# EAGLE design ArduTouch_stereo_v1.2c (EAGLE 7.5.0)
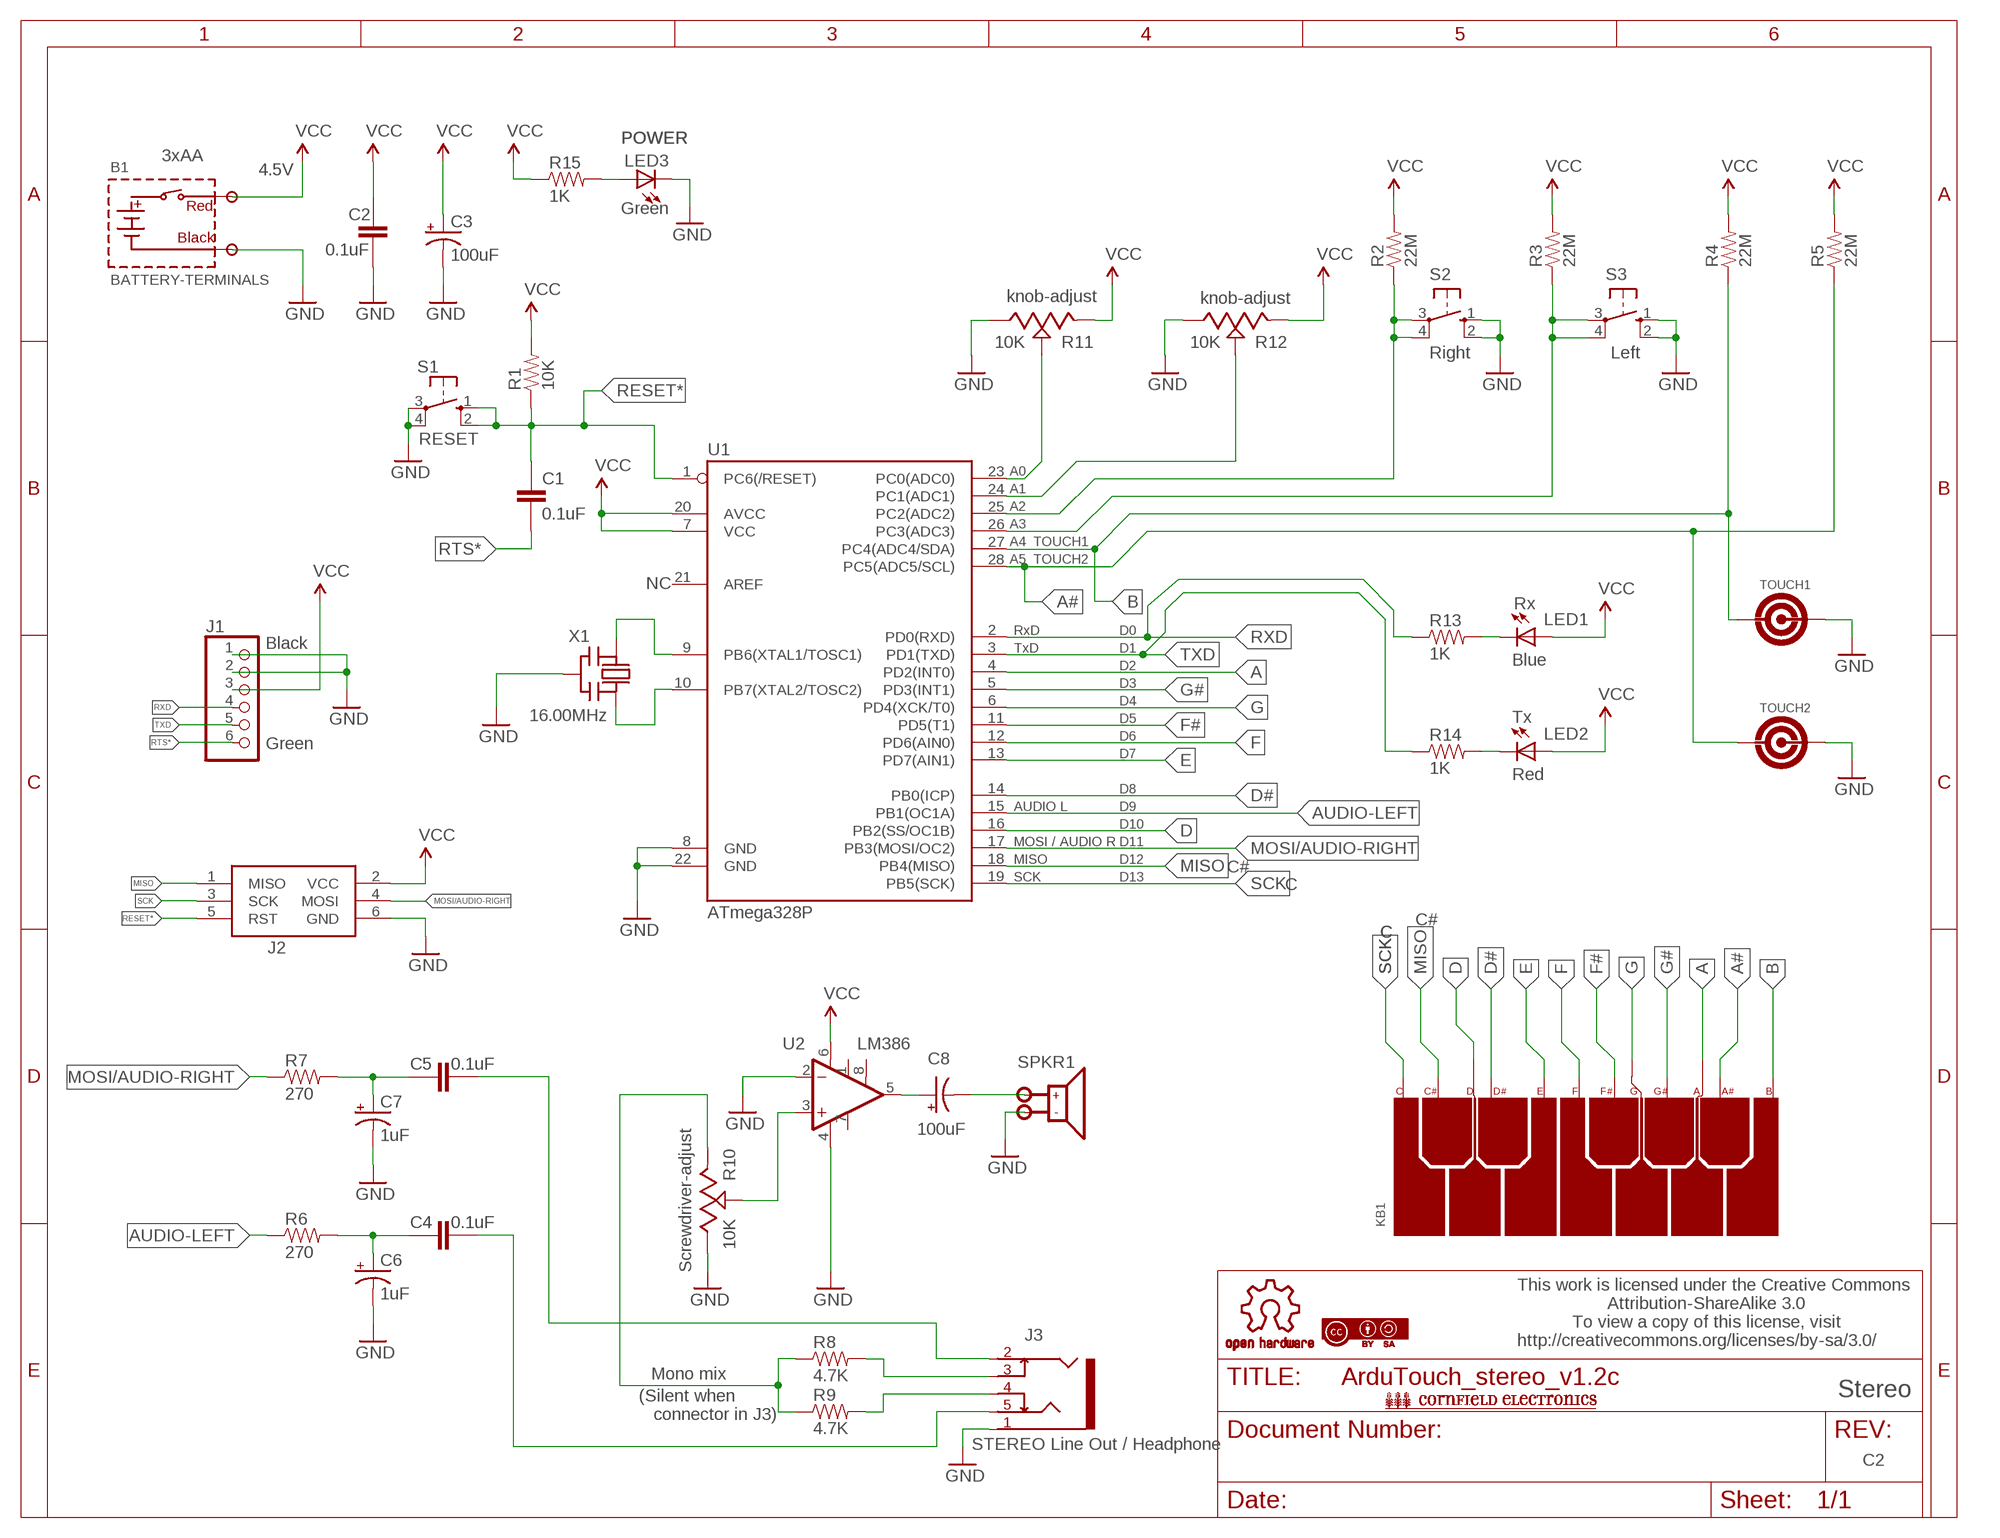
[diagram p0: schematic, sheet 1]

## Parts
B1  BATTERY-TERMINALS  [BATTERY-TERMINALS]
C1  0.1uF  CAPPTH  [CAP-PTH-SMALL]
C2  0.1uF  CAPPTH  [CAP-PTH-SMALL]
C3  100uF  CPOL-RADIAL-10UF-25V  [CPOL-RADIAL-10UF-25V]
C4  0.1uF  CAPPTH  [CAP-PTH-SMALL]
C5  0.1uF  CAPPTH  [CAP-PTH-SMALL]
C6  1uF  CPOL-RADIAL-10UF-25V  [CPOL-RADIAL-10UF-25V]
C7  1uF  CPOL-RADIAL-10UF-25V  [CPOL-RADIAL-10UF-25V]
C8  100uF  CPOL-RADIAL-10UF-25V  [CPOL-RADIAL-10UF-25V]
J1  PINHD-1X6LOCK  [1X06-BIGLOCK]
J2  ISP  AVRISP-6  [AVRISP]
J3  STEREO-AUDIO-3.5MM-SWITCHED  [STEREO-AUDIO-3.5MM-SWITCHED]
KB1  PCB-KEYBOARD4  [PCB-KEYBOARD4]
LED1  Blue  LED5MM  [LED5MM]
LED2  Red  LED5MM  [LED5MM]
LED3  Green  LED5MM  [LED5MM]
R1  10K  RESISTORPTH-1/4W  [AXIAL-0.4]
R2  22M  RESISTORPTH-1/4W  [AXIAL-0.4]
R3  22M  RESISTORPTH-1/4W  [AXIAL-0.4]
R4  22M  RESISTORPTH-1/4W  [AXIAL-0.4]
R5  22M  RESISTORPTH-1/4W  [AXIAL-0.4]
R6  270  RESISTORPTH-1/4W  [AXIAL-0.4]
R7  270  RESISTORPTH-1/4W  [AXIAL-0.4]
R8  4.7K  RESISTORPTH-1/4W  [AXIAL-0.4]
R9  4.7K  RESISTORPTH-1/4W  [AXIAL-0.4]
R10  10K  TRIMPOT-3319P-1  [TRIMPOT-3319P-1]
R11  10K  TRIMPOT-72PTR  [TRIMPOT-72PTR]
R12  10K  TRIMPOT-72PTR  [TRIMPOT-72PTR]
R13  1K  RESISTORPTH-1/4W  [AXIAL-0.4]
R14  1K  RESISTORPTH-1/4W  [AXIAL-0.4]
R15  1K  RESISTORPTH-1/4W  [AXIAL-0.4]
S1  TACTILE_SWITCH_6.3MM  [TACTILE_SWITCH_6.3MM]
S2  TACTILE_SWITCH_6.3MM  [TACTILE_SWITCH_6.3MM]
S3  TACTILE_SWITCH_6.3MM  [TACTILE_SWITCH_6.3MM]
SPKR1  SPEAKER-TERMINALS  [SPEAKER-TERMINALS]
TOUCH1  PCB-TOUCHPAD2  [PCB-TOUCHPAD2]
TOUCH2  PCB-TOUCHPAD2  [PCB-TOUCHPAD2]
U1  ATmega328P  ATMEGA328P_PDIP  [DIL28-3]
U2  LM386  [DIP08]
U$1  OSH-LOGO  [OSH-LOGO]
U$2  CC-BY-SA-LOGO2  [CC-BY-SA-LOGO2]
U$3  CORNFIELD-LOGO  [CORNFIELD-LOGO]
X1  16.00MHz  CERMOSCILL-THM  [CERM_OSC]

## Nets
A: KB1.A U1.4(PD2(INT0))
A0: R11.2(S) U1.23(PC0(ADC0))
A1: R12.2(S) U1.24(PC1(ADC1))
A2: R2.P$1 S2.3 S2.4 U1.25(PC2(ADC2))
A#: KB1.A# R5.P$1 TOUCH2.1 U1.28(PC5(ADC5/SCL))
AUDIO-LEFT: R6.P$1 U1.15(PB1(OC1A))
B: KB1.B R4.P$1 TOUCH1.1 U1.27(PC4(ADC4/SDA))
C+: R3.P$1 S3.3 S3.4 U1.26(PC3(ADC3))
D: KB1.D U1.16(PB2(SS/OC1B))
D#: KB1.D# U1.14(PB0(ICP))
E: KB1.E U1.13(PD7(AIN1))
F: KB1.F U1.12(PD6(AIN0))
F#: KB1.F# U1.11(PD5(T1))
G: KB1.G U1.6(PD4(XCK/T0))
G#: KB1.G# U1.5(PD3(INT1))
GND: B1.- C2.2 C3.- C6.- C7.- J1.1 J1.2 J2.6(GND) J3.1 LED3.K(C) R10.A R11.3(A) R12.3(A) S1.3 S1.4 S2.1 S2.2 S3.1 S3.2 SPKR1.- TOUCH1.2 TOUCH2.2 U1.8(GND) U1.22(GND) U2.2(-IN) U2.4(V-) X1.P$2(GND)
MISO: J2.1(MISO) KB1.C# U1.18(PB4(MISO))
MOSI/AUDIO-RIGHT: J2.4(MOSI) R7.P$1 U1.17(PB3(MOSI/OC2))
N$1: C8.- SPKR1.+
N$2: U1.9(PB6(XTAL1/TOSC1)) X1.P$1(IN)
N$3: U1.10(PB7(XTAL2/TOSC2)) X1.P$3(OUT)
N$4: C5.1 C7.+ R7.P$2
N$5: C8.+ U2.5(OUT)
N$6: J3.3 R8.P$2
N$7: J3.4 R9.P$2
N$8: R10.S U2.3(+IN)
N$9: C5.2 J3.2
N$10: C4.1 C6.+ R6.P$2
N$11: LED1.K(C) R13.P$2
N$12: LED2.K(C) R14.P$2
N$13: C4.2 J3.5
N$14: LED3.A R15.P$2
N$16: R8.P$1 R9.P$1 R10.E
RESET*: C1.1 J2.5(RST) R1.P$1 S1.1 S1.2 U1.1(PC6(/RESET))
RTS*: C1.2 J1.6
RXD: J1.4 R13.P$1 U1.2(PD0(RXD))
SCK: J2.3(SCK) KB1.C U1.19(PB5(SCK))
TXD: J1.5 R14.P$1 U1.3(PD1(TXD))
VCC: B1.+ C2.1 C3.+ J1.3 J2.2(VCC) LED1.A LED2.A R1.P$2 R2.P$2 R3.P$2 R4.P$2 R5.P$2 R11.1(E) R12.1(E) R15.P$1 U1.7(VCC) U1.20(AVCC) U2.6(V+)
Unconnected: U1.21(AREF) U2.1(GAIN) U2.7(BP) U2.8(GAIN)

## Notes on the sheet
- POWER | POWER
- 3xAA
- 4.5V
- knob-adjust | knob-adjust
- Right | Left
- RESET
- A0
- A1
- A2
- A3
- A4 | TOUCH1
- A5 | TOUCH2
- NC
- Rx
- RxD | D0
- Black | TxD | D1
- D2
- D3
- D4
- D5 | Tx
- D6
- Green
- D7
- D8
- AUDIO L | D9
- D10
- MOSI / AUDIO R | D11
- MISO | D12
- C#
- SCK | D13
- C
- C#
- C | C
- Screwdriver-adjust
- This work is licensed under the Creative Commons
                    Attribution-ShareAlike 3.0
             To view a copy of this license, visit
  http://creativecommons.org/licenses/by-sa/3.0/
- Mono mix
- Stereo
- (Silent when
     connector in J3)
- STEREO Line Out / Headphone
- C2

## Library data of the parts
B1 = Mitch-parts:BATTERY-TERMINALS: Battery terminals for 3xAA battery with switch with strain-relief holes
C1 C2 C4 C5 = Mitch-parts:CAP: Capacitor Standard 0603 ceramic capacitor, and 0.1" leaded capacitor.
C3 C6-C8 = Mitch-parts:CPOL-RADIAL-10UF-25V: Electrolytic Polarized
J1 = adafruit:PINHD-1X6: PIN HEADER
J2 = adafruit:AVRISP: AVR ISP HEADER Standard 6 pin header for AVR programming
J3 = Mitch-parts:STEREO-AUDIO-3.5MM-SWITCHED: 3.5mm mono audio jack, with switch Kycon STX-3120-5B-284C (284C is blue) Mouser part #: 806-STX-31205B284C (blue) 1 - ground 2 - tip 3 - tip switch 4 - ring switch 5 - ring
KB1 = Mitch-parts:PCB-KEYBOARD4: 1-octave PCB touch keyboard (without top C)
LED1-LED3 = Mitch-parts:LED5MM: LED, 5mm
R1-R9 R13-R15 = SparkFun-Passives:RESISTOR: Resistor Basic schematic elements and footprints for 0603, 1206, and PTH resistors.
R10 = Mitch-parts:TRIMPOT-3319P-1: Trimpot -- screwdriver adjust Bourns 3319P-1-103 (10K) Top Adjust Mouser part #: 652-3319P-1-103 (10K)
R11 R12 = Mitch-parts:TRIMPOT-72PTR: Trimpot -- knob adjust BI Technologies / TT Electronics 72PTR10KLF (10K) Mouser part #: 858-72PTR10KLF (10K)
S1-S3 = Mitch-parts:TACTILE_SWITCH_6.3MM: Tactile Switch 6.3mm x 6.3mm
SPKR1 = Mitch-parts:SPEAKER-TERMINALS: Speaker Terminals pads spaced 12mm holes: to fit 0.8mm (0.03") wires
TOUCH1 TOUCH2 = Mitch-parts:PCB-TOUCHPAD2: PCB resistive Touch-pad for touch-switch
U1 = SparkFun-DigitalIC:ATMEGA328P_PDIP: uC used in the Arduino 32kb flash, 1k EEPROM, 2k SRAM This is the through-hole version of this chip.
U2 = Mitch-parts:LM386: low voltage audio power amplifier
U$1 = Mitch-parts:OSH-LOGO: OSH Logo
U$2 = Mitch-parts:CC-BY-SA-LOGO2: CC BY-SA logo
U$3 = Mitch-parts:CORNFIELD-LOGO: Cornfield Electronics logo
X1 = adafruit:CERMOSCILL: Ceramic oscillator with built in capacitors such as ZTT-12MHz http://www.ladyada.net/library/eagle

## Board
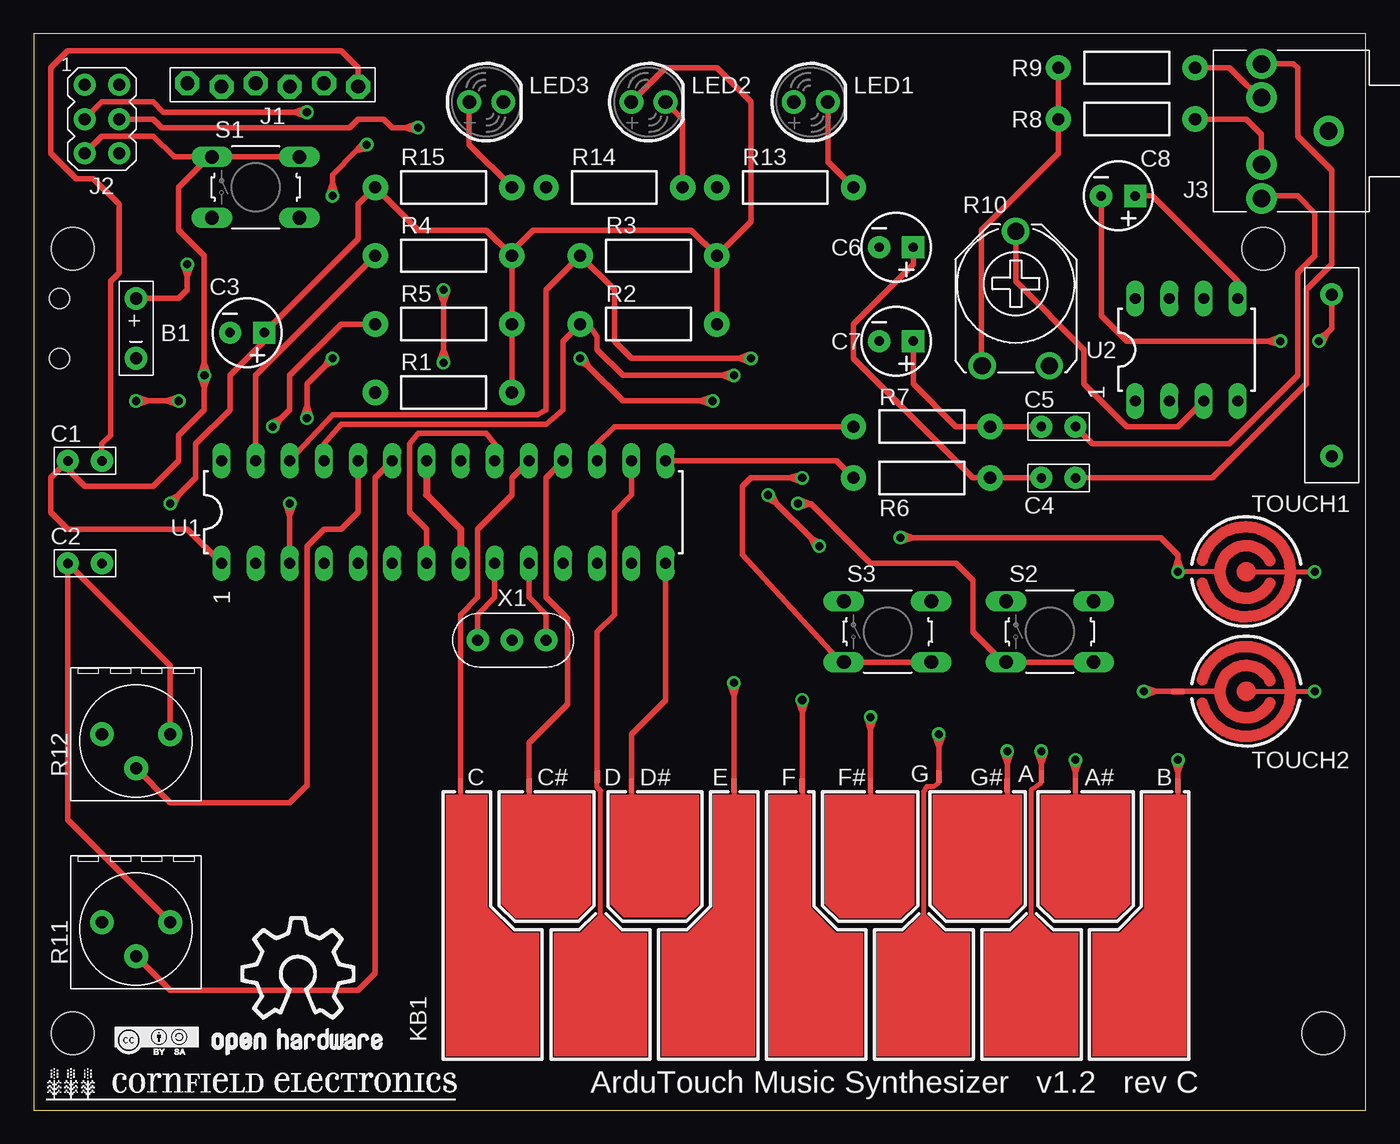
[diagram p1: board, top side]
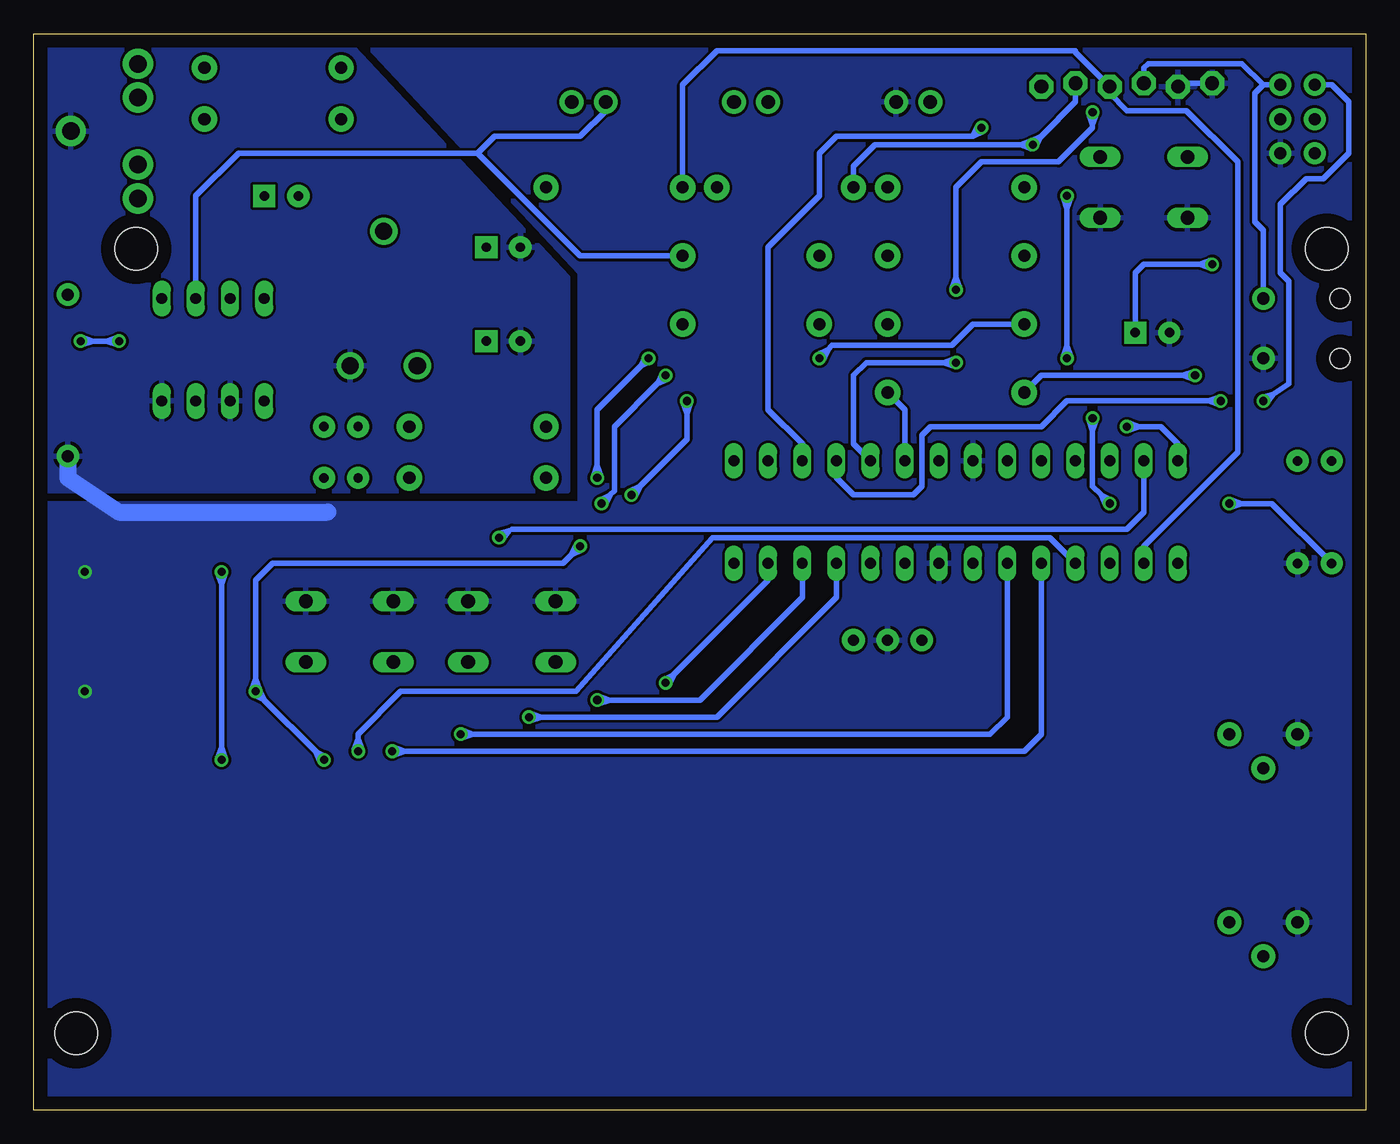
[diagram p2: board, bottom side, seen from below]

Size 99.06 x 80.01 mm. Coordinates in mm from the lower left corner, seen from the top.
Outline: 0,0 99.06,0 99.06,80.01 0,80.01 0,0
Copper layers (1*16): Top 0.035mm / dielectric 1.5mm / Bottom 0.035mm
Design rules "default *": minimum track width 10mil, minimum drill 20mil, track to track 8mil, track to pad 8mil, pad to pad 8mil, via to via 8mil, smd to smd 8mil, copper to edge 40mil, drill to drill 8mil, minimum pad ring 10mil, minimum via ring 8mil, stop-mask expansion 4mil, vias tented up to drill 0.61mm, thermal gap 10mil
Holes 3.17 mm at 2.92,5.71 95.89,5.71 91.44,64.01 2.92,64.01

### Footprints (pad centres in the part's own frame; a part is rotated, then mirrored left to right if it is on the bottom)
BATTERY-TERMINALS = drill 0.9 pad 1.676: + 0,2.54; - 0,-1.905 | hole 1.5: -5.715,-1.905; -5.715,2.54
CAP-PTH-SMALL = drill 0.7 pad 1.638: 1 -1.27,0; 2 1.27,0
CPOL-RADIAL-10UF-25V = drill 0.7 pad 1.651 square: + 1.27,0 | drill 0.7 pad 1.651: - -1.27,0
1X06-BIGLOCK = drill 1.016 pad 1.778 octagon: 1 -6.35,0.127; 2 -3.81,-0.127; 3 -1.27,0.127; 4 1.27,-0.127; 5 3.81,0.127; 6 6.35,-0.127
AVRISP = drill 0.9 pad 1.626: 1 -1.27,2.54; 2 1.27,2.54; 3 -1.27,0; 4 1.27,0; 5 -1.27,-2.54; 6 1.27,-2.54
STEREO-AUDIO-3.5MM-SWITCHED = drill 1.3 pad 2.261: 1 -1.05,0; 2 3.95,5; 3 3.95,2.5; 4 3.95,-2.5; 5 3.95,-5
PCB-KEYBOARD4 = smd 0.381 x 0.889: A 12.7,10.795; D -20.32,10.795; G 5.08,10.795 | smd 0.381 x 1.016: A# 15.24,10.16; B 22.86,10.16; C -30.48,10.16; C# -25.4,10.16; D# -17.78,10.16; E -10.16,10.16; F -5.08,10.16; F# 0,10.16; G# 10.16,10.16
LED5MM = drill 1.016 pad 1.778: A -1.27,0; K 1.27,0
AXIAL-0.4 = drill 0.9 pad 1.88: P$1 -5.08,0; P$2 5.08,0
TRIMPOT-3319P-1 = drill 1.27 pad 2.032: A 2.5,-5; E -2.5,-5; S 0,5
TRIMPOT-72PTR = drill 0.9 pad 1.778: 1 2.54,0; 2 0,-2.54; 3 -2.54,0
TACTILE_SWITCH_6.3MM = drill 1.016 long: 1 -3.251,2.261; 2 3.251,2.261; 3 -3.251,-2.261; 4 3.251,-2.261
SPEAKER-TERMINALS = drill 0.9 pad 1.676: + 0,6; - 0,-6
PCB-TOUCHPAD2 = smd 0.889 x 0.381: 1 -5.08,0; 2 5.08,0
DIL28-3 = drill 0.813 long: 1 -16.51,-3.81; 2 -13.97,-3.81; 3 -11.43,-3.81; 4 -8.89,-3.81; 5 -6.35,-3.81; 6 -3.81,-3.81; 7 -1.27,-3.81; 8 1.27,-3.81; 9 3.81,-3.81; 10 6.35,-3.81; 11 8.89,-3.81; 12 11.43,-3.81; 13 13.97,-3.81; 14 16.51,-3.81; 15 16.51,3.81; 16 13.97,3.81; 17 11.43,3.81; 18 8.89,3.81; 19 6.35,3.81; 20 3.81,3.81; 21 1.27,3.81; 22 -1.27,3.81; 23 -3.81,3.81; 24 -6.35,3.81; 25 -8.89,3.81; 26 -11.43,3.81; 27 -13.97,3.81; 28 -16.51,3.81
DIP08 = drill 0.813 long: 1 -3.81,-3.81; 2 -1.27,-3.81; 3 1.27,-3.81; 4 3.81,-3.81; 5 3.81,3.81; 6 1.27,3.81; 7 -1.27,3.81; 8 -3.81,3.81
CERM_OSC = drill 0.813 pad 1.676: P$1 -2.54,0; P$2 0,0; P$3 2.54,0

### Placement (x,y rotation side)
B1  7.62,57.78 0 top
C1  3.81,48.26 0 top
C2  3.81,40.64 0 top
C3  15.88,57.78 0 top
C4  76.2,46.99 0 top
C5  76.2,50.8 0 top
C6  64.14,64.14 0 top
C7  64.14,57.15 0 top
C8  80.64,67.94 0 top
J1  17.78,76.2 0 top
J2  5.08,73.66 0 top
J3  95.25,72.77 180 top
KB1  62.23,13.97 0 top
LED1  57.78,74.93 0 top
LED2  45.72,74.93 0 top
LED3  33.66,74.93 0 top
R1  30.48,53.34 0 top
R2  45.72,58.42 0 top
R3  45.72,63.5 0 top
R4  30.48,63.5 0 top
R5  30.48,58.42 0 top
R6  66.04,46.99 0 top
R7  66.04,50.8 0 top
R8  81.28,73.66 0 top
R9  81.28,77.47 0 top
R10  73.03,60.33 0 top
R11  7.62,13.97 0 top
R12  7.62,27.94 0 top
R13  55.88,68.58 0 top
R14  43.18,68.58 0 top
R15  30.48,68.58 0 top
S1  16.51,68.58 0 top
S2  75.56,35.56 0 top
S3  63.5,35.56 0 top
SPKR1  96.52,54.61 0 top
TOUCH1  90.17,40.01 0 top
TOUCH2  90.17,31.11 0 top
U1  30.48,44.45 0 top
U2  85.72,56.52 0 top
U$1  19.68,10.16 0 top
U$2  9.32,5.21 0 top
U$3  16.21,1.77 0 top
X1  35.56,34.92 0 top

### Tracks (layer width: path | path; a pad name or v marks a point on that pad's centre or on a via)
A  (via drill 0.6)
  Top 0.406: 74.93,25.77 v74.93,26.67 | 74.93,25.77 75.21,26.57 v74.93,26.67 | 74.93,25.77 74.65,26.57 v74.93,26.67 | KB1.A v74.93,26.67
  Bottom 0.406: v74.93,26.67 74.93,27.57 | 74.93,27.57 74.93,27.94 71.75,31.11 58.74,31.11 48.58,42.55 23.5,42.55 U1.4 | 74.93,27.57 74.65,26.77 v74.93,26.67 | 74.93,27.57 75.21,26.77 v74.93,26.67
A0
  Top 0.406: U1.23 25.4,46.99 25.4,19.05 25.4,10.16 24.13,8.89 10.16,8.89 R11.2
A1
  Top 0.406: U1.24 24.13,44.45 22.86,43.18 21.59,43.18 20.32,41.91 20.32,33.02 20.32,24.13 19.05,22.86 10.16,22.86 R12.2
A2  (via drill 0.6)
  Top 0.406: U1.25 21.59,49.53 22.86,50.99 38.1,50.99 39.37,52.07 39.37,57.15 R2.P$1 41.27,58.42 41.91,57.47 41.91,56.52 43.81,54.61 51.17,54.61 | 51.17,54.61 v52.07,54.61 | S2.4 S2.3 72.11,33.3 69.85,35.56 69.85,39.37 68.58,40.64 62.23,40.64 57.78,45.09 57.73,45.09 | 57.73,45.09 v56.83,45.09 | 51.17,54.61 51.97,54.33 v52.07,54.61 | 51.17,54.61 51.97,54.89 v52.07,54.61 | 57.73,45.09 56.93,45.37 v56.83,45.09 | 57.73,45.09 56.93,44.8 v56.83,45.09
  Bottom 0.406: v52.07,54.61 52.71,53.97 | 52.71,53.97 55.88,50.8 55.88,46.04 56.2,45.72 | 56.2,45.72 v56.83,45.09 | 52.71,53.97 52.34,54.74 v52.07,54.61 | 52.71,53.97 51.94,54.34 v52.07,54.61 | 56.2,45.72 56.56,44.96 v56.83,45.09 | 56.2,45.72 56.96,45.36 v56.83,45.09
A#  (via drill 0.6)
  Top 0.406: v40.64,55.88 41.28,55.24 | 41.28,55.24 43.81,52.7 49.58,52.7 | 49.58,52.7 v50.48,52.7 | v17.78,50.8 18.42,51.44 | 18.42,51.44 19.05,52.07 19.05,54.61 22.86,58.42 R5.P$1 | v58.42,41.91 57.78,42.55 | 57.78,42.55 55.25,45.08 | 55.25,45.08 v54.61,45.72 | 77.47,25.14 77.47,25.4 v77.47,26.04 | 88.24,31.11 83.45,31.11 | 83.45,31.11 v82.55,31.11 | 77.47,25.14 77.75,25.93 v77.47,26.04 | 77.47,25.14 77.19,25.93 v77.47,26.04 | 83.45,31.11 82.65,31.4 v82.55,31.11 | 83.45,31.11 82.65,30.83 v82.55,31.11 | 41.28,55.24 40.91,56.01 v40.64,55.88 | 41.28,55.24 40.51,55.61 v40.64,55.88 | 49.58,52.7 50.38,52.42 v50.48,52.7 | 49.58,52.7 50.38,52.99 v50.48,52.7 | 18.42,51.44 17.65,51.07 v17.78,50.8 | 18.42,51.44 18.05,50.67 v17.78,50.8 | 57.78,42.55 58.15,41.78 v58.42,41.91 | 57.78,42.55 58.55,42.18 v58.42,41.91 | 55.25,45.08 54.88,45.85 v54.61,45.72 | 55.25,45.08 54.48,45.45 v54.61,45.72 | KB1.A# 77.47,25.14
  Bottom 0.406: v77.47,26.04 78.11,26.67 | 78.11,26.67 81.91,30.48 | 81.91,30.48 v82.55,31.11 | R5.P$1 29.21,58.42 30.8,56.83 39.69,56.83 40,56.52 | v50.48,52.7 50.48,51.8 | 50.48,51.8 50.48,49.85 53.97,46.36 | 82.55,32.02 82.55,39.37 81.28,40.64 59.69,40.64 59.06,41.27 | 82.55,32.02 v82.55,31.11 | U1.28 13.97,49.53 15.24,50.8 16.88,50.8 | 16.88,50.8 v17.78,50.8 | 40,56.52 v40.64,55.88 | v54.61,45.72 53.97,46.36 | v58.42,41.91 59.06,41.27 | 78.11,26.67 77.34,26.31 v77.47,26.04 | 78.11,26.67 77.74,25.91 v77.47,26.04 | 81.91,30.48 82.68,30.84 v82.55,31.11 | 81.91,30.48 82.28,31.24 v82.55,31.11 | 82.55,32.02 82.27,31.21 v82.55,31.11 | 82.55,32.02 82.83,31.21 v82.55,31.11 | 40,56.52 40.37,55.75 v40.64,55.88 | 40,56.52 40.77,56.15 v40.64,55.88 | 50.48,51.8 50.77,52.6 v50.48,52.7 | 50.48,51.8 50.2,52.6 v50.48,52.7 | 16.88,50.8 17.68,50.52 v17.78,50.8 | 16.88,50.8 17.68,51.08 v17.78,50.8 | 59.06,41.27 58.69,42.04 v58.42,41.91 | 59.06,41.27 58.29,41.64 v58.42,41.91 | 53.97,46.36 54.34,45.59 v54.61,45.72 | 53.97,46.36 54.74,45.99 v54.61,45.72
AUDIO-LEFT
  Top 0.406: U1.15 59.69,48.26 R6.P$1
B  (via drill 0.6, 0.6 pad 0.3)
  Top 0.406: R4.P$1 16.51,54.61 U1.27 | 65.35,42.55 83.82,42.55 85.09,41.27 85.09,40.91 | 65.35,42.55 v64.45,42.55 | 85.09,25.14 85.09,25.4 v85.09,26.04 | TOUCH1.1 85.09,40.91 | 65.35,42.55 64.55,42.83 v64.45,42.55 | 65.35,42.55 64.55,42.26 v64.45,42.55 | 85.09,25.14 85.37,25.93 v85.09,26.04 | 85.09,25.14 84.81,25.93 v85.09,26.04 | 85.09,40.91 84.81,40.1 TOUCH1.1 | 85.09,40.91 85.37,40.1 TOUCH1.1 | KB1.B 85.09,25.14
  Bottom 0.406: v64.45,42.55 63.7,43.04 | 63.7,43.04 63.5,43.18 17.78,43.18 16.51,44.45 U1.27 | v85.09,26.04 85.09,26.93 | 85.09,26.93 85.09,39.1 | 85.09,39.1 TOUCH1.1 | 63.7,43.04 64.21,42.37 v64.45,42.55 | 63.7,43.04 64.53,42.84 v64.45,42.55 | 85.09,26.93 84.81,26.14 v85.09,26.04 | 85.09,26.93 85.37,26.14 v85.09,26.04 | 85.09,39.1 85.37,39.91 TOUCH1.1 | 85.09,39.1 84.81,39.91 TOUCH1.1
  other vias: 85.09,40.01
C+  (via drill 0.6)
  Top 0.406: U1.26 22.23,51.69 37.47,51.69 38.1,52.07 38.1,60.96 R3.P$1 43.18,60.96 43.18,57.15 44.45,55.88 52.44,55.88 | v53.34,55.88 52.44,55.88 | S3.4 S3.3 60.05,33.3 52.7,41.27 52.7,46.35 53.34,46.99 56.25,46.99 | 56.25,46.99 v57.15,46.99 | 56.25,46.99 57.05,46.71 v57.15,46.99 | 56.25,46.99 57.05,47.27 v57.15,46.99 | 52.44,55.88 53.24,55.6 v53.34,55.88 | 52.44,55.88 53.24,56.16 v53.34,55.88
  Bottom 0.406: 57.15,47.89 57.15,52.07 53.98,55.24 | 57.15,47.89 v57.15,46.99 | v53.34,55.88 53.98,55.24 | 57.15,47.89 56.87,47.09 v57.15,46.99 | 57.15,47.89 57.43,47.09 v57.15,46.99 | 53.98,55.24 53.61,56.01 v53.34,55.88 | 53.98,55.24 53.21,55.61 v53.34,55.88
D
  Top 0.406: U1.16 44.45,45.72 43.18,44.45 43.18,36.83 41.91,35.56 KB1.D
D#
  Top 0.406: U1.14 46.99,30.48 44.45,27.94 KB1.D#
E  (via drill 0.6)
  Top 0.406: 52.07,30.85 v52.07,31.75 | 52.07,30.85 52.35,31.65 v52.07,31.75 | 52.07,30.85 51.79,31.65 v52.07,31.75 | KB1.E 52.07,30.85
  Bottom 0.406: U1.13 44.45,39.37 51.43,32.39 | 51.43,32.39 v52.07,31.75 | 51.43,32.39 51.8,31.62 v52.07,31.75 | 51.43,32.39 52.2,32.02 v52.07,31.75
F  (via drill 0.6)
  Top 0.406: 57.15,29.58 v57.15,30.48 | 57.15,29.58 57.43,30.38 v57.15,30.48 | 57.15,29.58 56.87,30.38 v57.15,30.48 | KB1.F 57.15,29.58
  Bottom 0.406: U1.12 41.91,38.1 49.53,30.48 56.25,30.48 | 56.25,30.48 v57.15,30.48 | 56.25,30.48 57.05,30.2 v57.15,30.48 | 56.25,30.48 57.05,30.76 v57.15,30.48
F#  (via drill 0.6)
  Top 0.406: 62.23,28.31 v62.23,29.21 | 62.23,28.31 62.51,29.11 v62.23,29.21 | 62.23,28.31 61.95,29.11 v62.23,29.21 | KB1.F# 62.23,28.31
  Bottom 0.406: U1.11 39.37,38.1 48.26,29.21 61.33,29.21 | 61.33,29.21 v62.23,29.21 | 61.33,29.21 62.13,28.93 v62.23,29.21 | 61.33,29.21 62.13,29.49 v62.23,29.21
G  (via drill 0.6)
  Top 0.406: 67.31,27.04 v67.31,27.94 | 67.31,27.04 67.59,27.84 v67.31,27.94 | 67.31,27.04 67.03,27.84 v67.31,27.94 | KB1.G 67.31,27.04
  Bottom 0.406: v67.31,27.94 66.41,27.94 | 66.41,27.94 27.94,27.94 26.67,29.21 U1.6 | 66.41,27.94 67.21,27.66 v67.31,27.94 | 66.41,27.94 67.21,28.22 v67.31,27.94
G#  (via drill 0.6)
  Top 0.406: 72.39,25.77 v72.39,26.67 | 72.39,25.77 72.67,26.57 v72.39,26.67 | 72.39,25.77 72.11,26.57 v72.39,26.67 | KB1.G# v72.39,26.67
  Bottom 0.406: v72.39,26.67 71.49,26.67 | 71.49,26.67 25.4,26.67 24.13,27.94 U1.5 | 71.49,26.67 72.29,26.39 v72.39,26.67 | 71.49,26.67 72.29,26.95 v72.39,26.67
GND  (via drill 0.6 pad 0.3)
  Top 0.508: U1.22 29.21,45.72 31.75,43.18 U1.8
  Bottom 0.406: J1.1 13.72,76.33 J1.2
  Bottom 1.27: SPKR1.- 96.52,46.99 92.71,44.45 77.19,44.45
  other vias: 95.25,40.01 95.25,31.11
  pour Bottom: 77.47,81.28 59.37,61.91 59.37,46.04 100.33,46.04 100.33,81.28
  pour Bottom: 100.33,45.09 58.42,45.09 58.42,62.23 76.2,81.28 -1.27,81.28 -1.27,-1.27 100.33,-1.27
MISO  (via drill 0.6)
  Top 0.406: U1.18 38.1,46.99 38.1,38.1 39.69,36.51 39.69,30.16 36.83,27.3 KB1.C# | v7.62,52.7 8.52,52.7 | 8.52,52.7 9.89,52.7 | 9.89,52.7 v10.79,52.7 | 8.52,52.7 7.72,52.99 v7.62,52.7 | 8.52,52.7 7.72,52.42 v7.62,52.7 | 9.89,52.7 10.7,52.42 v10.79,52.7 | 9.89,52.7 10.7,52.99 v10.79,52.7
  Bottom 0.406: J2.1 2.54,76.2 1.27,74.93 1.27,71.12 3.17,69.22 4.45,69.22 6.35,67.31 6.35,62.23 5.71,61.59 5.71,53.98 6.87,53.2 | 6.87,53.2 v7.62,52.7 | U1.18 39.37,46.99 38.1,45.72 33.66,45.72 33.02,46.35 33.02,50.16 32.38,50.8 24.13,50.8 22.23,52.7 11.7,52.7 | v10.79,52.7 11.7,52.7 | 6.87,53.2 7.38,52.52 v7.62,52.7 | 6.87,53.2 7.69,53 v7.62,52.7 | 11.7,52.7 10.89,52.99 v10.79,52.7 | 11.7,52.7 10.89,52.42 v10.79,52.7
MOSI/AUDIO-RIGHT  (via drill 0.6)
  Top 0.406: J2.4 8.89,73.66 9.53,73.03 23.5,73.03 24.13,73.66 26.04,73.66 26.67,73.03 27.68,73.03 | v28.57,73.03 27.68,73.03 | U1.17 41.91,49.53 43.18,50.8 R7.P$1 | 27.68,73.03 28.48,72.74 v28.57,73.03 | 27.68,73.03 28.48,73.31 v28.57,73.03
  Bottom 0.406: 29.21,72.39 39.37,72.39 40.64,71.12 40.64,67.94 44.45,64.14 44.45,52.07 41.91,49.53 U1.17 | 29.21,72.39 v28.57,73.03 | 29.21,72.39 28.84,73.16 v28.57,73.03 | 29.21,72.39 28.45,72.75 v28.57,73.03
N$1  (via drill 0.6)
  Top 0.406: SPKR1.+ 96.52,58.1 96.2,57.79 | 96.2,57.79 v95.57,57.15 | C8.- 79.38,59.05 81.28,57.15 91.81,57.15 | 91.81,57.15 v92.71,57.15 | 96.2,57.79 95.44,57.42 v95.57,57.15 | 96.2,57.79 95.84,57.02 v95.57,57.15 | 91.81,57.15 92.61,56.87 v92.71,57.15 | 91.81,57.15 92.61,57.43 v92.71,57.15
  Bottom 0.406: v95.57,57.15 94.67,57.15 | 94.67,57.15 93.61,57.15 | 93.61,57.15 v92.71,57.15 | 94.67,57.15 95.47,56.87 v95.57,57.15 | 94.67,57.15 95.47,57.43 v95.57,57.15 | 93.61,57.15 92.81,57.43 v92.71,57.15 | 93.61,57.15 92.81,56.87 v92.71,57.15
N$2
  Top 0.406: U1.9 34.29,38.1 33.02,36.83 X1.P$1
N$3
  Top 0.406: X1.P$3 38.1,36.83 36.83,38.1 U1.10
N$4
  Top 0.406: C7.+ 65.41,53.98 68.58,50.8 R7.P$2 C5.1
N$5
  Top 0.406: U2.5 89.53,61.59 83.19,67.94 C8.+
N$6
  Top 0.406: R8.P$2 90.17,73.66 91.3,72.53 J3.3
N$7
  Top 0.406: R9.P$2 88.9,77.47 90.21,76.16 J3.4
N$8
  Top 0.406: U2.3 85.09,50.8 81.28,50.8 78.11,53.98 78.11,56.52 73.03,61.59 R10.S
N$9
  Top 0.406: C5.2 78.74,49.53 88.9,49.53 93.98,54.61 93.98,62.23 95.25,63.5 95.25,66.67 93.98,67.94 91.38,67.94 J3.2
N$10
  Top 0.406: C6.+ 65.41,62.87 60.96,58.42 60.96,55.88 69.85,46.99 R6.P$2 C4.1
N$11
  Top 0.406: R13.P$2 59.05,70.48 LED1.K
N$12
  Top 0.406: LED2.K 48.26,73.66 R14.P$2
N$13
  Top 0.406: C4.2 87.63,46.99 94.61,53.98 94.61,60.96 96.52,62.87 96.52,69.85 93.98,72.39 93.98,77.47 93.68,77.77 J3.5
N$14
  Top 0.406: LED3.A 32.38,71.75 R15.P$2
N$16
  Top 0.406: R9.P$1 R8.P$1 76.2,71.08 76.16,71.08 70.48,65.41 70.48,55.37 R10.E
RESET*  (via drill 0.6)
  Top 0.406: U1.1 11.43,43.18 2.54,43.18 1.27,44.45 1.27,46.99 C1.1 2.54,47.62 3.81,46.35 8.89,46.35 10.79,48.26 10.79,50.16 12.7,52.07 12.7,53.71 | v12.7,54.61 12.7,55.51 | 12.7,55.51 12.7,63.5 10.79,65.41 10.79,68.58 12.7,70.48 12.7,70.84 | v12.7,54.61 12.7,53.71 | J2.5 5.08,72.39 8.89,72.39 10.44,70.84 12.7,70.84 | S1.2 S1.1 12.7,70.84 | 12.7,55.51 12.42,54.71 v12.7,54.61 | 12.7,55.51 12.98,54.71 v12.7,54.61 | 12.7,53.71 12.98,54.51 v12.7,54.61 | 12.7,53.71 12.42,54.51 v12.7,54.61
  Bottom 0.406: 13.6,54.61 24.13,54.61 R1.P$1 | 13.6,54.61 v12.7,54.61 | 13.6,54.61 12.8,54.89 v12.7,54.61 | 13.6,54.61 12.8,54.33 v12.7,54.61
RTS*
  Top 0.406: J1.6 24.13,77.47 22.86,78.74 2.54,78.74 1.27,77.47 1.27,71.12 3.17,69.22 4.45,69.22 6.35,67.31 6.35,62.23 5.71,61.59 5.71,50.16 5.08,49.53 C1.2
RXD
  Bottom 0.406: U1.2 16.51,41.91 9.53,48.9 9.53,70.48 13.34,74.3 17.78,74.3 19.05,75.56 J1.4 21.59,78.61 21.59,78.74 48.26,78.74 50.8,76.2 R13.P$1
SCK  (via drill 0.6)
  Top 0.406: U1.19 35.56,46.99 35.56,45.72 33.02,43.18 33.02,38.1 31.75,36.83 KB1.C | J2.3 5.08,74.93 8.89,74.93 9.65,74.17 19.42,74.17 | v30.48,60.96 30.48,60.06 | 30.48,60.06 30.48,56.46 | 30.48,56.46 v30.48,55.56 | v20.32,74.17 19.42,74.17 | 19.42,74.17 20.22,73.89 v20.32,74.17 | 19.42,74.17 20.22,74.45 v20.32,74.17 | 30.48,60.06 30.76,60.86 v30.48,60.96 | 30.48,60.06 30.2,60.86 v30.48,60.96 | 30.48,56.46 30.2,55.66 v30.48,55.56 | 30.48,56.46 30.76,55.66 v30.48,55.56
  Bottom 0.406: U1.19 38.1,49.53 38.1,54.61 37.15,55.56 31.38,55.56 | 30.48,61.86 30.48,68.58 28.57,70.48 22.86,70.48 20.32,73.03 20.32,73.27 | 30.48,61.86 v30.48,60.96 | v30.48,55.56 31.38,55.56 | 20.32,73.27 v20.32,74.17 | 20.32,73.27 20.6,74.07 v20.32,74.17 | 20.32,73.27 20.04,74.07 v20.32,74.17 | 30.48,61.86 30.2,61.06 v30.48,60.96 | 30.48,61.86 30.76,61.06 v30.48,60.96 | 31.38,55.56 30.58,55.84 v30.48,55.56 | 31.38,55.56 30.58,55.28 v30.48,55.56
TXD  (via drill 0.6)
  Top 0.406: U1.3 19.05,44.19 | 19.05,44.19 v19.05,45.09 | v20.32,51.44 20.32,52.34 | 20.32,52.34 20.32,53.98 21.59,55.24 | 21.59,55.24 v22.23,55.88 | v24.77,71.75 24.45,71.75 23.99,71.3 | 23.99,71.3 22.23,69.53 22.23,68.84 | 22.23,68.84 v22.23,67.94 | 19.05,44.19 19.33,44.98 v19.05,45.09 | 19.05,44.19 18.77,44.98 v19.05,45.09 | 20.32,52.34 20.04,51.53 v20.32,51.44 | 20.32,52.34 20.6,51.53 v20.32,51.44 | 21.59,55.24 22.35,55.61 v22.23,55.88 | 21.59,55.24 21.95,56.01 v22.23,55.88 | 23.99,71.3 24.82,71.46 v24.77,71.75 | 23.99,71.3 24.54,71.95 v24.77,71.75 | 22.23,68.84 21.94,68.05 v22.23,67.94 | 22.23,68.84 22.51,68.05 v22.23,67.94
  Bottom 0.406: R14.P$1 38.1,70.17 36.51,71.75 25.66,71.75 | 25.66,71.75 v24.77,71.75 | v24.77,71.75 24.13,72.39 | 24.13,72.39 21.59,74.93 J1.5 | v19.05,45.09 19.69,45.72 | 19.69,45.72 20.32,46.35 20.32,50.53 | 20.32,50.53 v20.32,51.44 | v22.23,55.88 22.23,56.78 | 22.23,56.78 22.23,67.05 | 22.23,67.05 v22.23,67.94 | 19.69,45.72 18.92,45.36 v19.05,45.09 | 19.69,45.72 19.32,44.96 v19.05,45.09 | 20.32,50.53 20.6,51.34 v20.32,51.44 | 20.32,50.53 20.04,51.34 v20.32,51.44 | 22.23,56.78 21.94,55.98 v22.23,55.88 | 22.23,56.78 22.51,55.98 v22.23,55.88 | 25.66,71.75 24.86,72.04 v24.77,71.75 | 25.66,71.75 24.86,71.47 v24.77,71.75 | 24.13,72.39 24.49,71.63 v24.77,71.75 | 24.13,72.39 24.89,72.03 v24.77,71.75 | 22.23,67.05 22.51,67.84 v22.23,67.94 | 22.23,67.05 21.94,67.84 v22.23,67.94
VCC  (via drill 0.6)
  Top 0.406: U1.7 29.21,43.18 27.94,44.45 27.94,49.53 28.57,50.29 33.66,50.29 34.29,49.53 U1.20 | 10.8,45.72 12.06,46.99 12.06,49.53 14.61,52.07 14.61,54.61 17.14,57.15 C3.+ 24.13,64.77 24.13,67.31 R15.P$1 28.57,65.41 33.66,65.41 R4.P$2 | 10.8,45.72 v10.16,45.09 | R2.P$2 R3.P$2 | R3.P$2 48.9,65.41 37.15,65.41 35.56,63.82 R4.P$2 | R4.P$2 R5.P$2 R1.P$2 | LED2.A 46.99,77.47 50.8,77.47 53.34,74.93 53.34,66.04 R3.P$2 | v11.43,62.87 11.43,61.97 | 11.43,61.97 11.43,60.96 10.79,60.33 B1.+ | 11.43,61.97 11.71,62.77 v11.43,62.87 | 11.43,61.97 11.15,62.77 v11.43,62.87 | 10.8,45.72 10.03,45.36 v10.16,45.09 | 10.8,45.72 10.43,44.96 v10.16,45.09 | R12.1 10.16,33.02 C2.1 2.54,21.59 R11.1
  Bottom 0.406: J2.2 7.62,76.2 | 7.62,76.2 8.26,75.56 8.26,66.04 7.62,65.41 B1.+ | v11.43,62.87 12.33,62.87 | 12.33,62.87 16.51,62.87 17.14,62.23 C3.+ | v10.16,45.09 9.26,45.09 | 9.26,45.09 6.99,45.09 C2.1 | U1.20 34.29,52.07 R1.P$2 | J1.3 16.51,77.47 16.19,77.79 9.21,77.79 7.62,76.2 | 66.04,71.12 83.82,71.12 87,67.94 U2.6 | 66.04,71.12 64.77,72.39 58.42,72.39 56.52,74.3 LED1.A | 66.04,71.12 58.42,63.5 R3.P$2 | 12.33,62.87 11.53,63.15 v11.43,62.87 | 12.33,62.87 11.53,62.58 v11.43,62.87 | 9.26,45.09 10.06,44.8 v10.16,45.09 | 9.26,45.09 10.06,45.37 v10.16,45.09

### Text on the board
tPlace: 1 | 1 | ArduTouch Music Synthesizer v1.2 rev C
tDocu: POWER | Tx | Pin D1 | Rx | Pin D0 | 1 | 6 | BLK | GRN | Reset | Audio / Out | Red | Blk | NJM386BD | Speaker | Left | Right